# EAGLE design pmm (EAGLE 9.6.2)
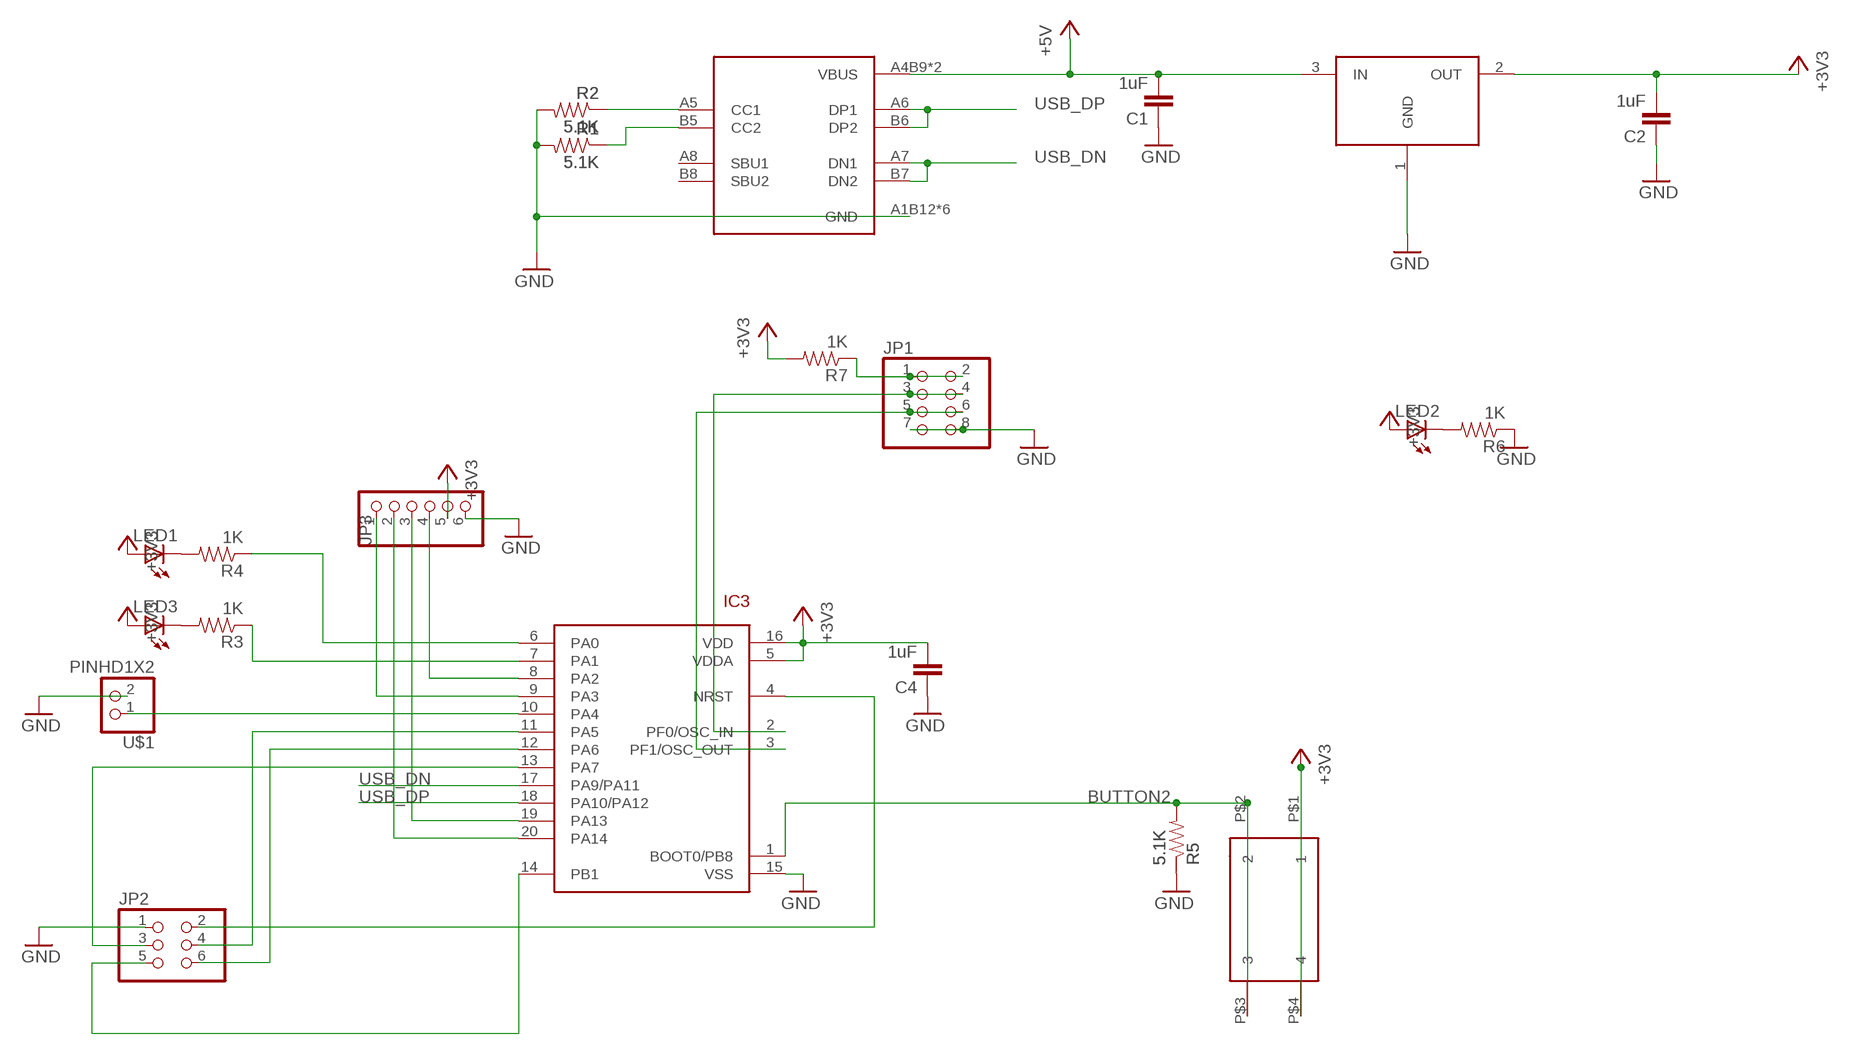
[diagram p0: schematic, sheet 1]

## Parts
C1  1uF  CAP0805  [0805@1]
C2  1uF  CAP0805  [0805@1]
C4  1uF  CAP0805  [0805@1]
IC3  STM32F042F4  [TSSOP20]
JP1  PINHEAD_PINHD-2X4  [PINHEAD_2X04]
JP2  PINHD-2X3  [2X03]
JP3  PINHD-1X6  [1X06]
LED1  LEDCHIP-LED0805  [CHIP-LED0805]
LED2  LEDCHIP-LED0805  [CHIP-LED0805]
LED3  LEDCHIP-LED0805  [CHIP-LED0805]
R1  5.1K  RESISTOR0805-RES  [0805]
R2  5.1K  RESISTOR0805-RES  [0805]
R3  1K  RESISTOR0805-RES  [0805]
R4  1K  RESISTOR0805-RES  [0805]
R5  5.1K  RESISTOR0805-RES  [0805]
R6  1K  RESISTOR0805-RES  [0805]
R7  1K  RESISTOR0805-RES  [0805]
SW4  324_SW  [342_SWICH_FOOT]
U2  USBC_16P  [USBC_16P_FOOT]
U4  XC6206_DEV  [SOT23R_INFINEON]
U$1  PINHD1X2  [1X02]

## Nets
+3V3: C2.2 C4.2 IC3.5(VDDA) IC3.16(VDD) JP3.5 LED1.A LED2.A LED3.A R7.2 SW4.P$1 SW4.P$4 U4.2(OUT)
+5V: C1.2 U2.A4B9(VBUS) U2.B4A9(VBUS) U4.3(IN)
BUTTON2: IC3.1(BOOT0/PB8) R5.2 SW4.P$2 SW4.P$3
GND: C1.1 C2.1 C4.1 IC3.15(VSS) JP1.7 JP1.8 JP2.1 JP3.6 R1.2 R2.2 R5.1 R6.1 U2.A1B12(GND) U2.B11A12(GND) U2.P$13(GND) U2.P$14(GND) U2.P$15(GND) U2.P$16(GND) U4.1(GND) U$1.2
N$1: LED3.C R3.2
N$2: IC3.2(PF0/OSC_IN) JP1.3 JP1.4
N$3: IC3.20(PA14) JP3.2
N$4: IC3.19(PA13) JP3.3
N$5: LED1.C R4.2
N$6: IC3.8(PA2) JP3.4
N$7: IC3.9(PA3) JP3.1
N$8: IC3.6(PA0) R4.1
N$9: IC3.7(PA1) R3.1
N$10: JP1.1 JP1.2 R7.1
N$11: IC3.11(PA5) JP2.4
N$12: IC3.12(PA6) JP2.6
N$13: IC3.13(PA7) JP2.3
N$14: IC3.14(PB1) JP2.5
N$15: IC3.4(NRST) JP2.2
N$16: IC3.10(PA4) U$1.1
N$29: LED2.C R6.2
N$31: R1.1 U2.B5(CC2)
N$33: R2.1 U2.A5(CC1)
SCL: IC3.3(PF1/OSC_OUT) JP1.5 JP1.6
USB_DN: IC3.17(PA9/PA11) U2.A7(DN1) U2.B7(DN2)
USB_DP: IC3.18(PA10/PA12) U2.A6(DP1) U2.B6(DP2)
Unconnected: U2.A8(SBU1) U2.B8(SBU2)

## Library data of the parts
C1 C2 C4 = clock:CAP: Capacitor Standard 0603 ceramic capacitor, and 0.1" leaded capacitor.
IC3 = tx:STM32F042F4
JP1 = pmm:PINHEAD_PINHD-2X4: PIN HEADER
JP2 = pinhead:PINHD-2X3: PIN HEADER
JP3 = pinhead:PINHD-1X6: PIN HEADER
LED1-LED3 = adafruit:LED: LED OSRAM: - CHIPLED LG R971, LG N971, LY N971, LG Q971, LY Q971, LO R971, LY R971 LH N974, LH R974 LS Q976, LO Q976, LY Q976 LO Q996 - Hyper CHIPLED LW Q18S LB Q993, LB Q99A, LB R99A - SideLED LS A670, LO A670, LY A670, LG A670, LP A670 LB A673, LV A673, LT A673, LW A673 LH A674 LY A675 LS A676, LA A676, LO A676, LY A676, LW A676 LS A679, LY A679, LG A679 - Hyper Micro SIDELED® LS Y876, LA Y876, LO Y876, LY Y876 LT Y87S - SmartLED LW L88C, LW L88S LB L89C, LB L89S, LG L890 LS L89K, LO L89K, LY L89K LS L896, LA L896, LO L896, LY L896 - TOPLED LS T670, LO T670, LY T670, LG T670, LP T670 LSG T670, LSP T670, LSY T670, LOP T670, LYG T670 LG T671, LOG T671, LSG T671 LB T673, LV T673, LT T673, LW T673 LH T674 LS T676, LA T676, LO T676, LY T676, LB T676, LH T676, LSB T676, LW T676 LB T67C, LV T67C, LT T67C, LS T67K, LO T67K, LY T67K, LW E67C LS E67B, LA E67B, LO E67B, LY E67B, LB E67C, LV E67C, LT E67C LW T67C LS T679, LY T679, LG T679 LS T770, LO T770, LY T770, LG T770, LP T770 LB T773, LV T773, LT T773, LW T773 LH T774 LS E675, LA E675, LY E675, LS T675 LS T776, LA T776, LO T776, LY T776, LB T776 LHGB T686 LT T68C, LB T68C - Hyper Mini TOPLED® LB M676 - Mini TOPLED Santana® LG M470 LS M47K, LO M47K, LY M47K Source: http://www.osram.convergy.de/
R1 R2 R5 = joyAnalog:RESISTOR: Resistor Basic schematic elements and footprints for 0603, 1206, and PTH resistors.
R3 R4 R6 R7 = SparkFun-Passives:RESISTOR: Resistor Basic schematic elements and footprints for 0603, 1206, and PTH resistors.
SW4 = 3pos_slide_switch_centered:324_SW
U2 = my_usbc_16p:USBC_16P
U4 = 3pos_slide_switch:XC6206_DEV
U$1 = adafruit_changed:PINHD1X2

## Board
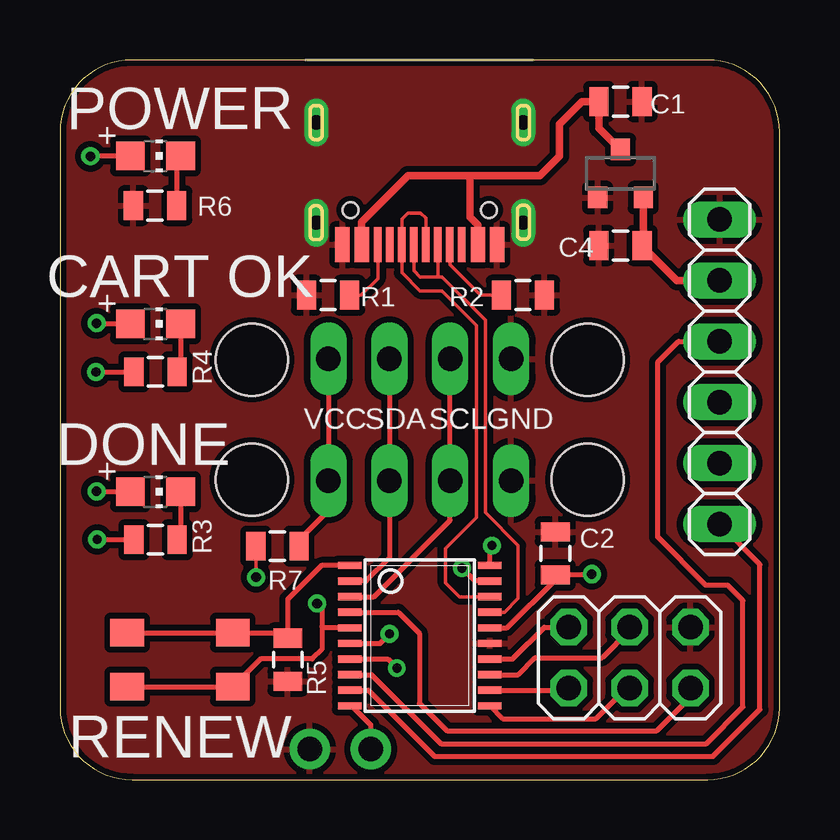
[diagram p1: board, top side]
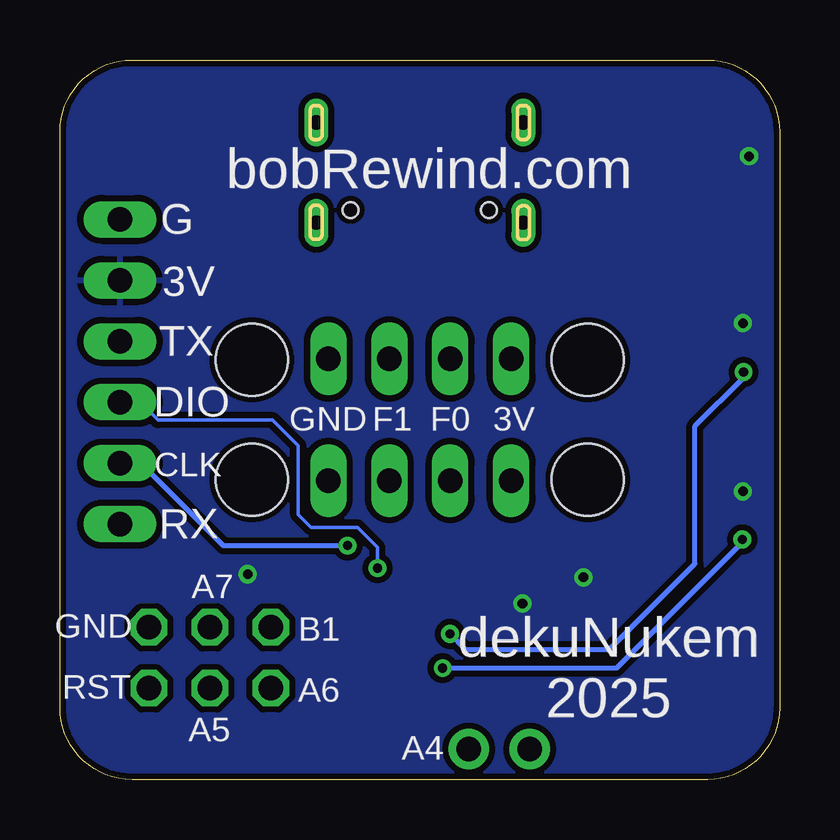
[diagram p2: board, bottom side, seen from below]

Size 30 x 30 mm. Coordinates in mm from the lower left corner, seen from the top.
Outline: 3,0 27,0 arc90 30,3 30,27 arc90 27,30 3,30 arc90 0,27 0,3 arc90 3,0
Copper layers (1*16): Top 0.035mm / dielectric 1.5mm / Bottom 0.035mm
Design rules "deku_2layer_6mil": minimum track width 6mil, minimum drill 15mil, track to track 6mil, track to pad 6mil, pad to pad 6mil, via to via 6mil, smd to smd 6mil, copper to edge 10mil, drill to drill 6mil, minimum pad ring 7mil, minimum via ring 7mil, stop-mask expansion 4mil, vias tented up to drill 25mil, thermal gap 10mil

### Footprints (pad centres in the part's own frame; a part is rotated, then mirrored left to right if it is on the bottom)
0805@1 = smd 0.8 x 1.2: 1 -0.9,0; 2 0.9,0
TSSOP20 = smd 0.305 x 0.991: 1 -2.925,-2.918; 2 -2.275,-2.918; 3 -1.625,-2.918; 4 -0.975,-2.918; 5 -0.325,-2.918; 6 0.325,-2.918; 7 0.975,-2.918; 8 1.625,-2.918; 9 2.275,-2.918; 10 2.925,-2.918; 11 2.925,2.918; 12 2.275,2.918; 13 1.625,2.918; 14 0.975,2.918; 15 0.325,2.918; 16 -0.325,2.918; 17 -0.975,2.918; 18 -1.625,2.918; 19 -2.275,2.918; 20 -2.925,2.918
PINHEAD_2X04 = drill 1.016 pad 1.422 long: 1 -3.81,-2.54; 2 -3.81,2.54; 3 -1.27,-2.54; 4 -1.27,2.54; 5 1.27,-2.54; 6 1.27,2.54; 7 3.81,-2.54; 8 3.81,2.54 | hole 3: 7,2.5; 7,-2.5; -7,-2.5; -7,2.5
2X03 = drill 1.016 octagon: 1 -2.54,-1.27; 2 -2.54,1.27; 3 0,-1.27; 4 0,1.27; 5 2.54,-1.27; 6 2.54,1.27
1X06 = drill 1.016 long: 1 -6.35,0; 2 -3.81,0; 3 -1.27,0; 4 1.27,0; 5 3.81,0; 6 6.35,0
CHIP-LED0805 = smd 1.2 x 1.2: A 0,-1.05; C 0,1.05
0805 = smd 0.8 x 1.2: 1 -0.9,0; 2 0.9,0
342_SWICH_FOOT = smd 1.4 x 1.15: P$1 -2.2,-1.125; P$2 -2.2,1.125; P$3 2.2,1.125; P$4 2.2,-1.125
USBC_16P_FOOT = smd 0.6 x 1.45: A1B12 -3.225,3.848; A4B9 -2.425,3.848; B4A9 2.425,3.848; B11A12 3.225,3.848 | smd 0.3 x 1.45: A5 -1.25,3.848; A6 -0.25,3.848; A7 0.25,3.848; A8 1.25,3.848; B5 1.75,3.848; B6 0.75,3.848; B7 -0.75,3.848; B8 -1.75,3.848 | drill 0.6 pad 1 long: P$13 -4.32,2.933; P$14 4.32,2.933; P$15 -4.32,-1.248; P$16 4.32,-1.248 | hole 0.65: -2.89,2.402; 2.89,2.402
SOT23R_INFINEON = smd 0.8 x 0.9: 1 -0.95,-1; 2 0.95,-1; 3 0,1
1X02 = drill 1.016 pad 1.676: 1 -1.27,0; 2 1.27,0

### Placement (x,y rotation side)
C1  23.37,28.27 180 top
C2  20.65,9.43 270 top
C4  23.37,22.27 0 top
IC3  15,6 270 top
JP1  15,15 0 top
JP2  23.75,5.08 180 top
JP3  27.5,17 90 top
LED1  3.98,19 270 top
LED2  3.98,26 270 top
LED3  3.98,12 270 top
R1  11.18,20.19 180 top
R2  19.3,20.19 0 top
R3  3.98,10 0 top
R4  3.98,17 0 top
R5  9.5,5 90 top
R6  3.96,23.93 0 top
R7  9.07,9.73 180 top
SW4  5,5 0 top
U2  15,26.15 180 top
U4  23.37,25.27 0 top
U$1  11.68,1.27 180 top

### Tracks (layer width: path | path; a pad name or v marks a point on that pad's centre or on a via)
+3V3  (via drill 0.4)
  Top 0.152: v8.18,8.43 8.17,8.44 R7.2
  Top 0.203: SW4.P$1 SW4.P$4 8.35,5.03 10.52,5.03 10.92,5.44 10.92,6.38 | v10.72,7.34 10.92,7.14 10.92,6.38 | IC3.5 10.97,6.33 10.92,6.38 | LED2.A 1.29,26 v1.27,25.98 | LED1.A 1.55,19 v1.52,19.02 | LED3.A 1.54,12 v1.52,12.01 | IC3.16 18.64,6.33 20.65,8.33 C2.2 22.14,8.53 v22.17,8.56
  Top 0.305: U4.2 24.32,22.32 C4.2 25.72,20.81 JP3.5
  pour Bottom (isolate 0.254): 30,27 30,3 arc-90 27,0 3,0 arc-90 0,3 0,27 arc-90 3,30 27,30 arc-90
+5V
  Top 0.305: U2.B4A9 12.57,23.24 14.5,25.17 17.09,25.17 | U2.A4B9 17.43,23.11 17.09,23.44 17.09,25.17 | U4.3 22.47,27.17 C1.2 21.76,28.27 20.83,27.33 20.83,25.98 20.02,25.17 17.09,25.17
BUTTON2
  Top 0.203: SW4.P$2 SW4.P$3 9.28,6.12 R5.2 9.5,7.52 10.91,8.93 IC3.1
GND
  pour Top (isolate 0.254): 3,0 27,0 arc90 30,3 30,27 arc90 27,30 3,30 arc90 0,27 0,3 arc90
N$1
  Top 0.203: R3.2 5.03,10.15 LED3.C
N$2
  Top 0.203: IC3.2 12.77,8.28 13.73,9.23 JP1.3 JP1.4
N$3  (via drill 0.38)
  Top 0.203: IC3.20 17.92,9.66 v18.01,9.75
  Bottom 0.203: JP3.2 26.63,13.19 23.19,9.75 v18.01,9.75
N$4  (via drill 0.38)
  Top 0.203: IC3.19 17.3,8.28 v16.76,8.81
  Bottom 0.152: v16.76,8.81 16.76,9.68 17.6,10.52 19.53,10.52 20.07,11.05 20.07,13.92 21.13,14.99 25.91,14.99 26.65,15.73 JP3.3
N$5
  Top 0.203: LED1.C 5.03,17.15 R4.2
N$6
  Top 0.203: IC3.8 13,4.38 15.88,1.5 26.95,1.5 28.47,3.02 28.47,7.47 27.84,8.1 26.92,8.1 24.92,10.11 24.92,17.4 25.79,18.27 JP3.4
N$7
  Top 0.203: IC3.9 12.86,3.73 15.62,0.96 27.23,0.96 29.18,2.92 29.18,8.96 JP3.1
N$8  (via drill 0.38)
  Top 0.203: IC3.6 13.35,5.67 v13.74,6.07 | v1.5,16.99 R4.1
  Bottom 0.203: v13.74,6.07 13.11,5.44 7.09,5.44 3.53,8.99 3.53,14.73 1.5,16.76 v1.5,16.99
N$9  (via drill 0.38)
  Top 0.203: IC3.7 13.67,5.03 v14.05,4.65 | v1.55,10.01 R3.1
  Bottom 0.203: v14.05,4.65 6.78,4.65 1.55,9.88 v1.55,10.01
N$10
  Top 0.203: R7.1 9.97,9.99 11.19,11.21 JP1.1 JP1.2
N$11
  Top 0.203: IC3.11 18.45,2.54 22.35,2.54 23.62,3.81 JP2.4
N$12
  Top 0.203: IC3.12 21.12,3.73 JP2.6
N$13
  Top 0.203: IC3.13 19.11,4.38 19.81,5.08 22.61,5.08 23.75,6.22 JP2.3
N$14
  Top 0.203: IC3.14 18.87,5.03 20.19,6.35 JP2.5
N$15
  Top 0.203: IC3.4 14.11,6.97 14.99,6.1 14.99,3.17 16.13,2.03 24.89,2.03 26.29,3.43 JP2.2
N$16
  Top 0.203: IC3.10 12.16,3.08 12.95,2.29 U$1.1
N$29
  Top 0.203: LED2.C 4.86,25.83 R6.2
N$31
  Top 0.152: U2.B5 13.25,20.89 12.55,20.19 R1.1
N$33
  Top 0.152: U2.A5 16.25,21.47 17.53,20.19 R2.1
SCL
  Top 0.203: IC3.3 13.09,7.62 16.27,10.81 JP1.5 JP1.6
USB_DN
  Top 0.152: IC3.17 18.53,6.97 19.1,7.54 19.1,9.75 17.73,11.12 17.73,19.15 15.93,20.95 15.77,20.95 | U2.A7 14.75,21.22 15.01,20.95 15.77,20.95 | 15.77,20.95 15.75,20.98 U2.B7
USB_DP
  Top 0.152: IC3.18 16.66,7.62 16.08,8.2 16.08,9.63 17.37,10.92 17.37,18.92 15.93,20.37 15.01,20.37 14.25,21.13 U2.B6 14.25,23.37 14.5,23.62 15.04,23.62 15.25,23.41 U2.A6

### Text on the board
tNames: POWER | CART OK | VCC | SDA | SCL | GND | DONE | RENEW
bNames: bobRewind.com | G | 3V | TX | DIO | 3V | F0 | F1 | GND | CLK | RX | A7 | B1 | GND | dekuNukem / 2025 | A6 | RST | A5 | A4